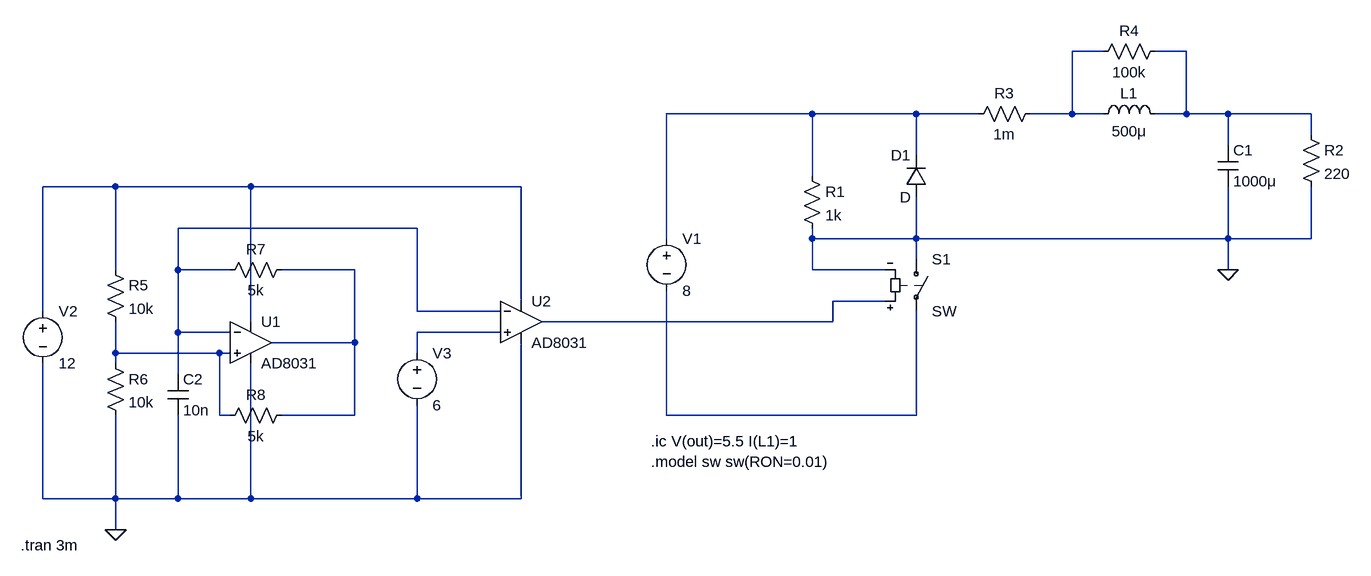
[diagram p0: schematic lab_sim2.asc]
lab_sim2.asc, the LTspice schematic file:
Version 4
SHEET 1 1048 680
WIRE 624 -192 576 -192
WIRE 752 -192 704 -192
WIRE 176 -96 -48 -96
WIRE 336 -96 176 -96
WIRE 432 -96 336 -96
WIRE 576 -96 576 -192
WIRE 576 -96 512 -96
WIRE 624 -96 576 -96
WIRE 752 -96 752 -192
WIRE 752 -96 704 -96
WIRE 816 -96 752 -96
WIRE 944 -96 816 -96
WIRE 944 -64 944 -96
WIRE 816 -48 816 -96
WIRE 336 -32 336 -96
WIRE 176 0 176 -96
WIRE -896 16 -1008 16
WIRE -688 16 -896 16
WIRE -272 16 -688 16
WIRE -432 80 -800 80
WIRE -48 96 -48 -96
WIRE 176 96 176 80
WIRE 336 96 336 32
WIRE 336 96 176 96
WIRE 816 96 816 16
WIRE 816 96 336 96
WIRE 944 96 944 16
WIRE 944 96 816 96
WIRE 336 128 336 96
WIRE -896 144 -896 16
WIRE -800 144 -800 80
WIRE -720 144 -800 144
WIRE -528 144 -640 144
WIRE 176 144 176 96
WIRE 288 144 176 144
WIRE 816 144 816 96
WIRE -272 192 -272 16
WIRE 288 192 208 192
WIRE -1008 208 -1008 16
WIRE -432 208 -432 80
WIRE -304 208 -432 208
WIRE -688 224 -688 16
WIRE 208 224 208 192
WIRE 208 224 -240 224
WIRE -800 240 -800 144
WIRE -720 240 -800 240
WIRE -304 240 -432 240
WIRE -528 256 -528 144
WIRE -528 256 -656 256
WIRE -896 272 -896 224
WIRE -736 272 -896 272
WIRE -720 272 -736 272
WIRE -432 272 -432 240
WIRE -896 288 -896 272
WIRE -800 304 -800 240
WIRE -736 368 -736 272
WIRE -720 368 -736 368
WIRE -528 368 -528 256
WIRE -528 368 -640 368
WIRE -48 368 -48 176
WIRE 336 368 336 208
WIRE 336 368 -48 368
WIRE -1008 496 -1008 288
WIRE -896 496 -896 368
WIRE -896 496 -1008 496
WIRE -800 496 -800 368
WIRE -800 496 -896 496
WIRE -688 496 -688 288
WIRE -688 496 -800 496
WIRE -432 496 -432 352
WIRE -432 496 -688 496
WIRE -272 496 -272 256
WIRE -272 496 -432 496
WIRE -896 544 -896 496
FLAG 816 144 0
FLAG -896 544 0
DATAFLAG 16 368 ""
SYMBOL voltage -48 80 R0
SYMATTR InstName V1
SYMATTR Value 8
SYMBOL res 160 -16 R0
SYMATTR InstName R1
SYMATTR Value 1k
SYMBOL res 928 -80 R0
SYMATTR InstName R2
SYMATTR Value 220
SYMBOL res 528 -112 R90
WINDOW 0 0 56 VBottom 2
WINDOW 3 32 56 VTop 2
SYMATTR InstName R3
SYMATTR Value 1m
SYMBOL sw 336 112 R0
SYMATTR InstName S1
SYMBOL diode 352 32 R180
WINDOW 0 24 64 Left 2
WINDOW 3 24 0 Left 2
SYMATTR InstName D1
SYMBOL ind 608 -80 R270
WINDOW 0 32 56 VTop 2
WINDOW 3 5 56 VBottom 2
SYMATTR InstName L1
SYMATTR Value 500μ
SYMBOL res 720 -208 R90
WINDOW 0 0 56 VBottom 2
WINDOW 3 32 56 VTop 2
SYMATTR InstName R4
SYMATTR Value 100k
SYMBOL cap 800 -48 R0
SYMATTR InstName C1
SYMATTR Value 1000μ
SYMBOL voltage -1008 192 R0
WINDOW 123 0 0 Left 0
WINDOW 39 0 0 Left 0
SYMATTR InstName V2
SYMATTR Value 12
SYMBOL res -912 128 R0
SYMATTR InstName R5
SYMATTR Value 10k
SYMBOL res -912 272 R0
SYMATTR InstName R6
SYMATTR Value 10k
SYMBOL res -624 128 R90
WINDOW 0 0 56 VBottom 2
WINDOW 3 32 56 VTop 2
SYMATTR InstName R7
SYMATTR Value 5k
SYMBOL res -624 352 R90
WINDOW 0 0 56 VBottom 2
WINDOW 3 32 56 VTop 2
SYMATTR InstName R8
SYMATTR Value 5k
SYMBOL cap -816 304 R0
SYMATTR InstName C2
SYMATTR Value 10n
SYMBOL OpAmps\\AD8031 -688 192 R0
SYMATTR InstName U1
SYMBOL OpAmps\\AD8031 -272 160 R0
SYMATTR InstName U2
SYMBOL voltage -432 256 R0
SYMATTR InstName V3
SYMATTR Value 6
TEXT -72 408 Left 2 !.ic V(out)=5.5 I(L1)=1\n.model sw sw(RON=0.01)
TEXT -1042 568 Left 2 !.tran 3m

The netlist it stands for:
* lab_sim2.asc
V1 N003 N010 8
R1 N003 0 1k
R2 N002 0 220
R3 N001 N003 1m
S1 0 N010 N007 0 SW
D1 0 N003 D
L1 N001 N002 500μ
R4 N002 N001 100k
C1 N002 0 1000μ
V2 N004 0 12
R5 N004 N009 10k
R6 N009 0 10k
R7 N006 N005 5k
R8 N006 N009 5k
C2 N005 0 10n
XU1 N009 N005 N004 0 N006 AD8031  ; pins In+ In- V+ V- OUT
XU2 N008 N005 N004 0 N007 AD8031  ; pins In+ In- V+ V- OUT
V3 N008 0 6
.model D D
.lib standard.dio
.ic V(out)=5.5 I(L1)=1
.model sw sw(RON=0.01)
.tran 3m
.backanno
.end